# EAGLE schematic AutoExhaustFan (EAGLE 7.2.0)
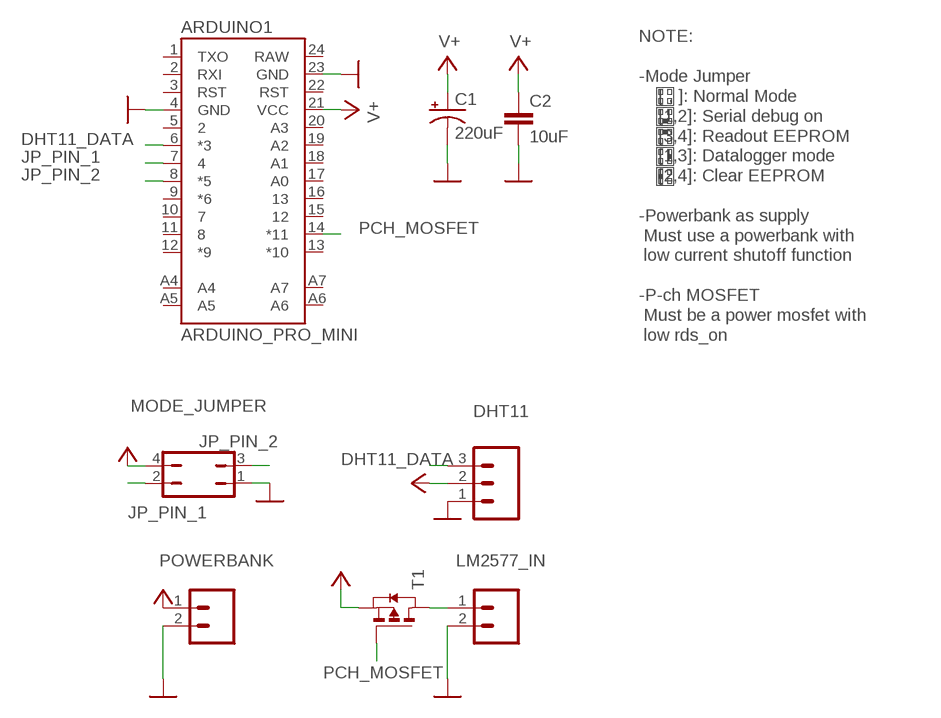
[diagram p0: schematic, sheet 1]

## Parts
ARDUINO1  ARDUINO_PRO_MINI  [ARDUINO_PRO_MINI]
C1  220uF  CAP_POLPTH1  [CPOL-RADIAL-100UF-25V]
C2  10uF  CAP1206  [1206]
DHT11  M03PTH  [1X03]
LM2577_IN  M02LOCK  [1X02_LOCK]
MODE_JUMPER  JP2Q  [JP2Q]
POWERBANK  M02LOCK  [1X02_LOCK]
T1  PMOSSOT23  [SOT-23]

## Nets
DHT11_DATA: ARDUINO1.6(*3) DHT11.3
GND: ARDUINO1.4(GND) ARDUINO1.23(GND) C1.2(-) C2.2 DHT11.1 LM2577_IN.2 MODE_JUMPER.1 POWERBANK.2
JP_PIN_1: ARDUINO1.7 MODE_JUMPER.2
JP_PIN_2: ARDUINO1.8(*5) MODE_JUMPER.3
N$1: LM2577_IN.1 T1.1(D)
PCH_MOSFET: ARDUINO1.14(*11) T1.3(G)
V+: ARDUINO1.21(VCC) C1.1(+) C2.1 DHT11.2 MODE_JUMPER.4 POWERBANK.1 T1.2(S)
Unconnected: ARDUINO1.1(TXO) ARDUINO1.2(RXI) ARDUINO1.3(RST) ARDUINO1.5 ARDUINO1.9(*6) ARDUINO1.10 ARDUINO1.11 ARDUINO1.12(*9) ARDUINO1.13(*10) ARDUINO1.15 ARDUINO1.16 ARDUINO1.17(A0) ARDUINO1.18(A1) ARDUINO1.19(A2) ARDUINO1.20(A3) ARDUINO1.22(RST) ARDUINO1.24(RAW) ARDUINO1.A4 ARDUINO1.A5 ARDUINO1.A6 ARDUINO1.A7

## Notes on the sheet
- NOTE:
  
  -Mode Jumper
      [ , ]: Normal Mode
      [1,2]: Serial debug on
      [3,4]: Readout EEPROM
      [1,3]: Datalogger mode
      [2,4]: Clear EEPROM 
  
  -Powerbank as supply
   Must use a powerbank with
   low current shutoff function
  
  -P-ch MOSFET
   Must be a power mosfet with
   low rds_on

## Library data of the parts
ARDUINO1 = SparkFun-Boards:ARDUINO_PRO_MINI
C1 = SparkFun-Capacitors:CAP_POL: Capacitor Polarized These are standard SMD and PTH capacitors. Normally 10uF, 47uF, and 100uF in electrolytic and tantalum varieties. Always verify the external diameter of the through hole cap, it varies with capacity, voltage, and manufacturer. The EIA devices should be standard.
C2 = SparkFun-Capacitors:CAP: Capacitor Standard 0603 ceramic capacitor, and 0.1" leaded capacitor.
DHT11 = dcadc:M03: Header 3 Standard 3-pin 0.1" header. Use with straight break away headers (SKU : PRT-00116), right angle break away headers (PRT-00553), swiss pins (PRT-00743), machine pins (PRT-00117), and female headers (PRT-00115). Molex polarized connector foot print use with SKU : PRT-08232 with associated crimp pins and housings.
LM2577_IN POWERBANK = SparkFun-Connectors:M02: Standard 2-pin 0.1" header. Use with - straight break away headers ( PRT-00116) - right angle break away headers (PRT-00553) - swiss pins (PRT-00743) - machine pins (PRT-00117) - female headers (PRT-00115) Molex polarized connector foot print use with: PRT-08233 with associated crimp pins and housings. 2.54_SCREWTERM for use with PRT-10571. 3.5mm Screw Terminal footprints for PRT-08084 5mm Screw Terminal footprints for use with PRT-08432
MODE_JUMPER = jumper:JP2Q: JUMPER
T1 = zetex:PMOSSOT23: MOS FET; OC_FARNELL: unknown; OC_NEWARK: unknown